# EAGLE schematic AB1 (EAGLE 7.4.0)
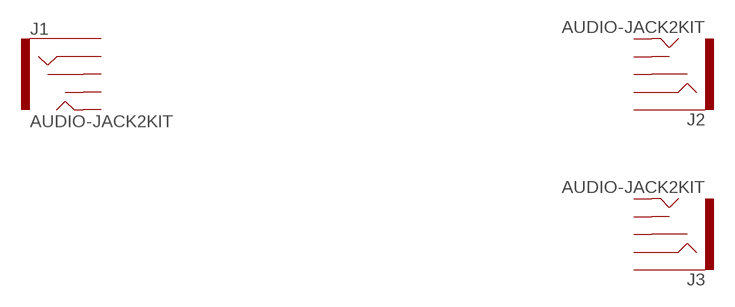
[diagram p0: schematic, sheet 1]

## Parts
J1  AUDIO-JACK2KIT  [AUDIO-JACK-KIT]
J2  AUDIO-JACK2KIT  [AUDIO-JACK-KIT]
J3  AUDIO-JACK2KIT  [AUDIO-JACK-KIT]
Unconnected: J1.RING J1.RSH J1.SLEEVE J1.TIP J1.TSH J2.RING J2.RSH J2.SLEEVE J2.TIP J2.TSH J3.RING J3.RSH J3.SLEEVE J3.TIP J3.TSH

## Library data of the parts
J1-J3 = SparkFun-Connectors:AUDIO-JACK2: Stereo audio jack with bypass switches. SMT version used on LilyPad MP3 board.; PROD_ID: CONN-08774